# Altium schematic sheet ST-LINK_V2-1.SchDoc: ST-LINK V2-1
size A4; Date: Not used; ApprovedBy: Not used; CheckedBy: Not used; Author: Not used; CompanyName: STMicroelectronics; DrawnBy: Not used; Engineer: Not used; Organization: Not used; Address1: Not used; Address2: Not used; Address3: Not used; Address4: Not used; DocumentNumber: Not used; Revision: Not used; SheetNumber: 8; SheetTotal: 8; CurrentTime: Not used; CurrentDate: Not used; Time: Not used; DocumentFullPathAndName: Not used; DocumentName: Not used; ModifiedDate: Not used; ImagePath: Not used; ProjectName: Not used; Application_BuildNumber: Not used
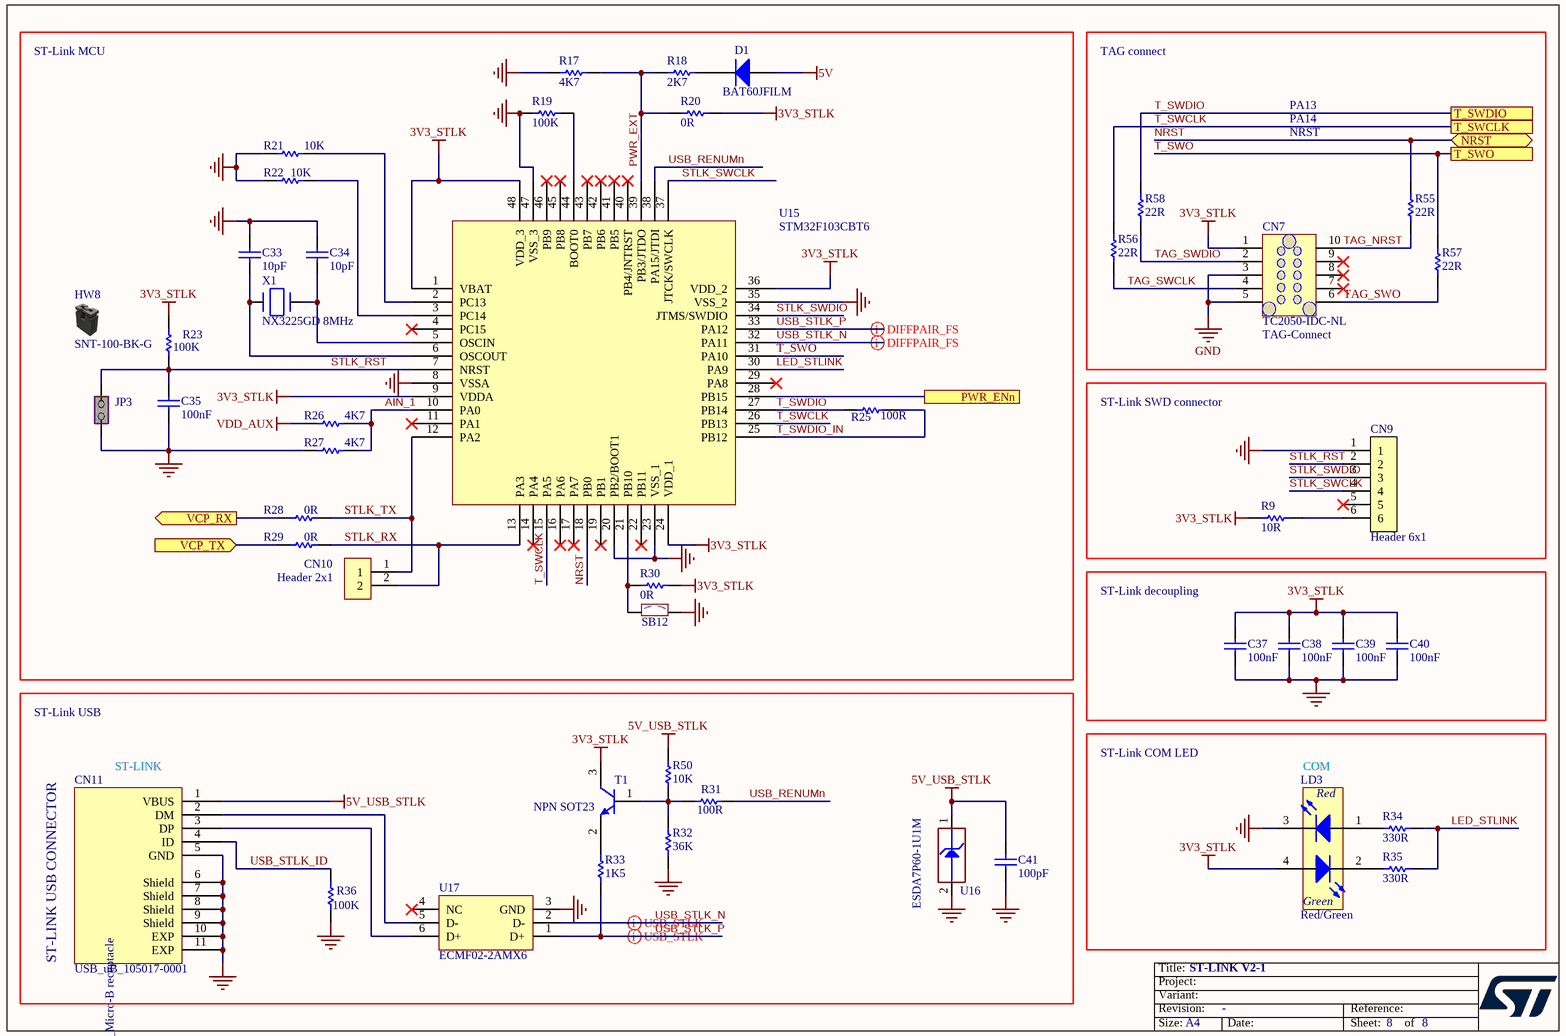
[diagram p0: ST-LINK_V2-1.SchDoc]

## Parts
C33  value 10pF  [C0402]  (hidden comment: Capacitor)
C34  value 10pF  [C0402]  (hidden comment: Capacitor)
C35  value 100nF  [C0402]  (hidden comment: Capacitor)
C37  value 100nF  [C0402]  (hidden comment: Capacitor)
C38  value 100nF  [C0402]  (hidden comment: Capacitor)
C39  value 100nF  [C0402]  (hidden comment: Capacitor)
C40  value 100nF  [C0402]  (hidden comment: Capacitor)
C41  value 100pF  [C0603_H0P8]  (hidden comment: Capacitor)
CN7  value TC2050-IDC-NL  [CON_TAG-C_TC2050-IDC-NL]  (hidden comment: Tag-10-C)
CN9  Header 6x1  [CON_SAMTEC_TSW-106-14-G-S]
CN10  Header 2x1  [CON_SAMTEC_TSW-102-07-G-S]
CN11  value USB_uB_105017-0001  [CON_USBMICROB_MOLEX_105017-0001_H2P90]  (hidden comment: USB_uB_105017.0001)
D1  BAT60JFILM  [DIO_SOD323]
HW8  value SNT-100-BK-G  (hidden comment: Shunt Black 2.54mm)  (mechanical)
JP3  Jumper_Header 2x1 Fitted  [CON_SAMTEC_TSW-102-07-G-S]  (value not drawn)
LD3  value Red/Green  [LED_BI-GR_WE-150141SV73110]  (hidden comment: LED_BICOLOR)
R9  value 10R  [R0402]  (hidden comment: Resistor)
R17  value 4K7  [R0402]  (hidden comment: Resistor)
R18  value 2K7  [R0402]  (hidden comment: Resistor)
R19  value 100K  [R0402]  (hidden comment: Resistor)
R20  value 0R  [R0402]  (hidden comment: Resistor)
R21  value 10K  [R0402]  (hidden comment: Resistor)
R22  value 10K  [R0402]  (hidden comment: Resistor)
R23  value 100K  [R0402]  (hidden comment: Resistor)
R25  value 100R  [R0402]  (hidden comment: Resistor)
R26  value 4K7  [R0402]  (hidden comment: Resistor)
R27  value 4K7  [R0402]  (hidden comment: Resistor)
R28  value 0R  [R0402]  (hidden comment: Resistor)
R29  value 0R  [R0402]  (hidden comment: Resistor)
R30  value 0R  [R0402]  (hidden comment: Resistor)
R31  value 100R  [R0402]  (hidden comment: Resistor)
R32  value 36K  [R0402]  (hidden comment: Resistor)
R33  value 1K5  [R0402]  (hidden comment: Resistor)
R34  value 330R  [R0402]  (hidden comment: Resistor)
R35  value 330R  [R0402]  (hidden comment: Resistor)
R36  value 100K  [R0402]  (hidden comment: Resistor)
R50  value 10K  [R0402]  (hidden comment: Resistor)
R55  value 22R  [R0402]  (hidden comment: Resistor)
R56  value 22R  [R0402]  (hidden comment: Resistor)
R57  value 22R  [R0402]  (hidden comment: Resistor)
R58  value 22R  [R0402]  (hidden comment: Resistor)
SB12  SB_OFF  [SOLDER-BRIDGE_R0603-0R]  (value not drawn)
T1  value NPN SOT23  [NPN_SOT23]  (hidden comment: 9013-SOT23)
U15  STM32F103CBT6  [ICC_LQFP48_7X7_P050]
U16  value ESDA7P60-1U1M  [ESD_QFN2_1P6X1_P125]  (hidden comment: ESD-TRANSIL)
U17  ECMF02-2AMX6  [ESD_QFN-6L_1P7X1P5_P050]
X1  value NX3225GD 8MHz  [CRY_NX3225GD_2P]  (hidden comment: XTAL_2_PINS)

## Blocks framed on the sheet
ST-Link MCU: C33-C35 CN10 D1 HW8 JP3 R17-R23 R25-R30 SB12 U15 X1
ST-Link SWD connector: CN9 R9
ST-Link decoupling: C37-C40
ST-LINK USB CONNECTOR: C41 CN11 R31-R33 R36 R50 T1 U16 U17

## Ports
NRST (bidir), PWR_ENn, T_SWCLK, T_SWDIO, T_SWO, VCP_RX (out), VCP_TX (in)

## Nets
3V3_STLK: C37.2 C38.2 C39.2 C40.2 CN7.1 LD3.4(Green_anode) R9.1 R20.2 R23.2 R30.2 T1.3(C) U15.1(VBAT) U15.9(VDDA) U15.24(VDD_1) U15.36(VDD_2) U15.48(VDD_3)
5V: D1.1(A)
5V_USB_STLK: C41.1 CN11.1(VBUS) R50.2 U16.1(IO1)
GND: C33.2 C34.2 C35.1 C37.1 C38.1 C39.1 C40.1 C41.2 CN7.3 CN7.5 CN9.1 CN11.5(GND) CN11.6(Shield) CN11.7(Shield) CN11.8(Shield) CN11.9(Shield) CN11.10(EXP) CN11.11(EXP) JP3.2(NO) LD3.3(RED_cathode) R17.1 R19.1 R21.2 R22.1 R27.1 R32.1 R36.1 SB12.2 U15.8(VSSA) U15.20(PB2/BOOT1) U15.23(VSS_1) U15.35(VSS_2) U15.47(VSS_3) U16.2(GND) U17.3(GND)
VDD_AUX: R26.1
AIN_1: R26.2 R27.2 U15.10(PA0)
LED_STLINK: R34.2 R35.2 U15.30(PA9)
NRST: R55.2 U15.18(PB0) ; port NRST
PWR_ENn: U15.28(PB15) ; port PWR_ENn
PWR_EXT: R17.2 R18.1 R20.1 U15.39(PB3/JTDO)
STLK_RST: C35.2 CN9.2 JP3.1(COMMON) R23.1 U15.7(NRST)
STLK_RX: CN10.2 R29.2 U15.13(PA3)
STLK_SWCLK: CN9.4 U15.37(JTCK/SWCLK)
STLK_SWDIO: CN9.3 U15.34(JTMS/SWDIO)
STLK_TX: CN10.1 R28.1 U15.12(PA2)
T_SWCLK: R56.2 U15.15(PA5) U15.26(PB13) ; port T_SWCLK
T_SWDIO: R25.1 R58.2 U15.27(PB14) ; port T_SWDIO
T_SWDIO_IN: R25.2 U15.25(PB12)
T_SWO: R57.1 U15.31(PA10) ; port T_SWO
TAG_NRST: CN7.10 R55.1
TAG_SWCLK: CN7.4 R56.1
TAG_SWDIO: CN7.2 R58.1
TAG_SWO: CN7.6 R57.2
USB_RENUMn: R31.2 U15.38(PA15/JTDI)
USB_STLK_ID: CN11.4(ID) R36.2
USB_STLK_N: U15.32(PA11) U17.2(D-)
USB_STLK_P: R33.1 U15.33(PA12) U17.1(D+)
VCP_RX: R28.2 ; port VCP_RX
VCP_TX: R29.1 ; port VCP_TX
NetC33_1: C33.1 U15.6(OSCOUT) X1.2(X2)
NetC34_1: C34.1 U15.5(OSCIN) X1.1(X1)
NetCN9_6: CN9.6 R9.2
NetCN11_2: CN11.2(DM) U17.5(D-)
NetCN11_3: CN11.3(DP) U17.6(D+)
NetD1_2: D1.2(K) R18.2
NetLD3_1: LD3.1(Red_anode) R34.1
NetLD3_2: LD3.2(Green_cathode) R35.1
NetR19_2: R19.2 U15.44(BOOT0)
NetR21_1: R21.1 U15.2(PC13)
NetR22_2: R22.2 U15.3(PC14)
NetR30_1: R30.1 SB12.1 U15.21(PB10)
NetR31_1: R31.1 R32.2 R50.1 T1.1(B)
NetR33_2: R33.2 T1.2(E)

Not connected (* = marked no-connect by the designer): CN7 7* 8* 9*; CN9 5*; U15 4(PC15)* 11(PA1)* 14(PA4)* 16(PA6)* 17(PA7)* 19(PB1)* 22(PB11)* 29(PA8)* 40(PB4/JNTRST)* 41(PB5)* 42(PB6)* 43(PB7)* 45(PB8)* 46(PB9)*; U17 4(NC)*

## Layout directives
differential pair: USB_STLK_N, USB_STLK_P

## Notes on the sheet
- TAG connect
- PA13
- PA14
- NRST
- (near CN7) TAG-Connect
- ST-Link USB
- (near CN11) ST-LINK
- ST-Link COM LED
- COM
- Title:
- Project:
- Size:
- Revision:
- Variant:
- A4
- -
- Date:
- Reference:
- Sheet:
- of
- (in symbol MCD-00028) USB_Micro-B receptacle
- (in symbol MCD-02631) Red; Green

## Library data of the parts
C33 C34 = MCD-00015: Capacitor, MLCC, 10pF, 50V, NPO, +/-5%, 0402, T=0,5mm; Manufacturer_Part_Number: CC0402JRNPO9BN100; Manufacturer: YAGEO; Part_Preference: Recommended; Internal_Part_Number: MCD-00015; Status: Released; Part_Type: Capacitor; Package: C0402; ComponentLink1URL: http://tunmcdsvn.tun.st.com/Component_Datasheet_Library/Trunk/Capacitors/Yageo_Capacitor_NP0_16V-to-50V
C35 C37-C40 = MCD-00006: Capacitor, MLCC, 100nF, 16V, X7R, +/-10%, 0402, T=0.5mm; Manufacturer_Part_Number: CC0402KRX7R7BB104; Manufacturer: YAGEO; Alternate_Manufacturer_Part_Number: GCM155R71C104KA55D; Alternate_Manufacturer: MURATA; Part_Preference: Recommended; Order_Code_RS: 616-9701; Internal_Part_Number: MCD-00006; Status: Released; Part_Type: Capacitor; Package: C0402; ComponentLink1URL: http://tunmcdsvn.tun.st.com/Component_Datasheet_Library/Trunk/Capacitors/Yageo_Multilayer_Capacitor_X7R_series_100pF_to_22uF; Order_Code_Digikey: 311-1338-1-ND; Order_Code_Farnell: 9402047
C41 = MCD-01648: Capacitor,MLCC,100pF 50V,NPO,+/-5%, 0603,T=0,8mm; Manufacturer_Part_Number: CC0603JRNPO9BN101; Manufacturer: YAGEO; Part_Preference: Recommended; Order_Code_RS: 625-0267; Internal_Part_Number: MCD-01648; Status: Released; Part_Type: Capacitor; Package: C0603; ComponentLink1URL: http://tunmcdsvn.tun.st.com/Component_Datasheet_Library/Trunk/Capacitors/Yageo_UPY-GP_NP0_16V-to-50V/YAGEO_NP0_UPY-GP_NP0_16V-to-50V_16.pdf; Order_Code_Digikey: 311-1069-1-ND; Order_Code_Farnell: 722080
CN7 = MCD-00031: Tag_Connector Header, 10x2, No legs; Manufacturer_Part_Number: TC2050-IDC-NL-FP; Manufacturer: TAG-CONNECT LLC; Part_Preference: Recommended; Internal_Part_Number: MCD-00031; Status: Released; Part_Type: Connector; ComponentLink1URL: http://tunmcdsvn.tun.st.com/Component_Datasheet_Library/Trunk/Connectors/TAG_Connector_TC2050-IDC-NLFP
CN9 = MCD-01592: Header 6x1, 2,54mm, height 10.67mm; Part_Type: Connector; Manufacturer_Part_Number: TSW-106-14-G-S; Manufacturer: SAMTEC; Part_Preference: Recommended; Order_Code_RS: 180-1121; Internal_Part_Number: MCD-01592; Value: Header 6x1; Status: Checked; ComponentLink1URL: http://tunmcdsvn.tun.st.com/Component_Datasheet_Library/Trunk/Connectors/Samtec_TSW-HTSW-series/Samtec_TSW-HTSW-series.pdf; Alternate_Manufacturer: N/A; Alternate_Manufacturer_Part_Number: N/A; Order_Code_Digikey: SAM1053-06-ND; Order_Code_Farnell: 2037181
CN10 = MCD-00032: Header, 2x1, 2,54mm, VR, TH, Height 5.84mm/2.54mm; Manufacturer_Part_Number: TSW-102-07-G-S; Manufacturer: SAMTEC; Part_Type: Connector; Alternate_Manufacturer_Part_Number: 313102S111116; Alternate_Manufacturer: JIUBABA; Part_Preference: Recommended; Value: Header 2x1; Internal_Part_Number: MCD-00032; Status: Released; ComponentLink1URL: http://tunmcdsvn.tun.st.com/Component_Datasheet_Library/Trunk/Connectors/Samtec_TSW-HTSW-series
CN11 = MCD-00028: USB-MICRO-B, 0.65mm, RA, SMT, Bottom Mount,; Manufacturer_Part_Number: 1050170001; Manufacturer: MOLEX; Part_Type: Connector; Part_Preference: Recommended; Internal_Part_Number: MCD-00028; Status: Released; ComponentLink1URL: http://tunmcdsvn.tun.st.com/Component_Datasheet_Library/Trunk/Connectors/Molex_Connector-USB-microB_105017-0001
D1 = MCD-00034: Manufacturer: STMICROELECTRONICS; Part_Type: Diode; BMS_Part_Number: 9151097; Part_Preference: Recommended; Manufacturer_HQ_COO: EU; Internal_Part_Number: MCD-00034; Value: BAT60JFILM; Manufacturer_Part_Number: BAT60JFILM; Status: Released; ComponentLink1URL: http://tunmcdsvn.tun.st.com/Component_Datasheet_Library/Trunk/Diodes/STM_Diode_BAT60JFILM-SOD323
HW8 = MCD-00122: Shunt, 2.54mm, Black, 4.3A, 6.1mm, 5mR; Part_Type: Misc; Part_Preference: Recommended; Manufacturer: SAMTEC; Full_Alternate_Internal_Part_Number: MCD-00043; Partial_Alternate_Internal_Part_Number: MCD-01849; Order_Code_RS: 158-7784; Component_Country_Of_Origin: China, Costa Rica, Malaysia, USA, Vietnam; ShowFields: YES; ID: 2749; Internal_Part_Number: MCD-00122; Status: Released; Manufacturer_Part_Number: SNT-100-BK-G; Package: 2.54x5.08mm; ComponentLink1URL: http://tunmcdsvn.tun.st.com/Component_Documentation_Library/Trunk/Misc/SAMTEC_SNT-100-BK-G; Order_Code_Digikey: SAM8858-ND; Order_Code_Farnell: 2505007
JP3 = MCD-01904: Header, 2x1, 2,54mm, VR, TH, Height 5.84mm/2.54mm - Shunt Fitted by default; Part_Type: Connector; Manufacturer_Part_Number: TSW-102-07-G-S; Manufacturer: SAMTEC; Part_Preference: Recommended; Order_Code_RS: 155-7981; Internal_Part_Number: MCD-01904; Value: Header 2x1; Status: Checked; ComponentLink1URL: http://tunmcdsvn.tun.st.com/Component_Datasheet_Library/Trunk/Connectors/Samtec_TSW-HTSW-series; Alternate_Manufacturer: N/A; Alternate_Manufacturer_Part_Number: N/A; Order_Code_Digikey: SAM1029-02-ND; Order_Code_Farnell: 2505044
LD3 = MCD-02631: LED Bicolor, Red/Green, 2V, 20mA, 4-PLCC; Part_Type: Display; Part_Preference: Recommended; Manufacturer: WURTH ELEKTRONIK; Manufacturer_Part_Number: 150141SV73110; Order_Code_RS: 184-6963; Component_Country_Of_Origin: China; ShowFields: YES; ID: 4737; Internal_Part_Number: MCD-02631; Status: Released; Package: 4-PLCC; ComponentLink1URL: http://tunmcdsvn.tun.st.com/Component_Documentation_Library/Trunk/Display/WURTH_ELEKTRONIK_150141SV73110; Order_Code_Digikey: 732-13404-2-ND; Order_Code_Farnell: 2990869
R9 = MCD-00358: Resistor,10R,0402,1%,1/16W; Manufacturer_Part_Number: RC0402FR-0710RL; Manufacturer: YAGEO; Part_Preference: Recommended; Order_Code_RS: 618-5848; Internal_Part_Number: MCD-00358; Status: Released; Part_Type: Resistor; Package: R0402; ComponentLink1URL: http://tunmcdsvn.tun.st.com/Component_Datasheet_Library/Trunk/Resistors/Yageo_Resistor_RC0402-series; Order_Code_Digikey: 311-10.0LRCT-ND; Order_Code_Farnell: 9238999
R17 R26 R27 = MCD-00065: Resistor,4K7,0402,1%,1/16W; Manufacturer_Part_Number: RC0402FR-074K7L; Manufacturer: YAGEO; Alternate_Manufacturer_Part_Number: RT0402FRE074K7L; Part_Preference: Recommended; Internal_Part_Number: MCD-00065; Alternate_Manufacturer: YAGEO; Status: Released; Part_Type: Resistor; ComponentLink1URL: http://tunmcdsvn.tun.st.com/Component_Datasheet_Library/Trunk/Resistors/Yageo_Resistor_RC0402-series; Package: R0402; Order_Code_Digikey: 311-4.7KLRCT-ND; Order_Code_Farnell: 9239316; Order_Code_RS: N/A
R18 = MCD-00055: Resistor,2K7,0402,1%,1/16W; Manufacturer_Part_Number: RC0402FR-072K7L; Manufacturer: YAGEO; Part_Preference: Recommended; Internal_Part_Number: MCD-00055; Status: Released; Part_Type: Resistor; ComponentLink1URL: http://tunmcdsvn.tun.st.com/Component_Datasheet_Library/Trunk/Resistors/Yageo_Resistor_RC0402-series; Package: R0402; Order_Code_Digikey: 311-2.70KLRCT-ND; Order_Code_Farnell: 9239286; Order_Code_RS: N/A
R19 R23 R36 = MCD-00059: Resistor,100K,0402,1%,1/16W; Manufacturer_Part_Number: RC0402FR-07100KL; Manufacturer: YAGEO; Alternate_Manufacturer_Part_Number: RT0402FRE07100KL; Part_Preference: Recommended; Internal_Part_Number: MCD-00059; Alternate_Manufacturer: YAGEO; Status: Released; Part_Type: Resistor; ComponentLink1URL: http://tunmcdsvn.tun.st.com/Component_Datasheet_Library/Trunk/Resistors/Yageo_Resistor_RC0402-series; Package: R0402; Order_Code_Digikey: 311-100KLRTR-ND; Order_Code_Farnell: 2421891; Order_Code_RS: N/A
R20 R28-R30 = MCD-00052: Resistor,0R,0402,5%,1/16W; Manufacturer_Part_Number: RC0402JR-070RL; Manufacturer: YAGEO; Part_Preference: Recommended; Order_Code_RS: 618-5804; Internal_Part_Number: MCD-00052; Status: Released; Part_Type: Resistor; ComponentLink1URL: http://tunmcdsvn.tun.st.com/Component_Datasheet_Library/Trunk/Resistors/Yageo_Resistor_RC0402-series; Package: R0402; Order_Code_Digikey: 311-0.0JRCT-ND; Order_Code_Farnell: 9232516RL
R21 R22 R50 = MCD-00053: Resistor,10K,0402,1%,1/16W; Manufacturer_Part_Number: RC0402FR-0710KL; Manufacturer: YAGEO; BMS_Part_Number: 9131590; Part_Preference: Recommended; Internal_Part_Number: MCD-00053; Status: Released; Part_Type: Resistor; ComponentLink1URL: http://tunmcdsvn.tun.st.com/Component_Datasheet_Library/Trunk/Resistors/Yageo_Resistor_RC0402-series; Package: R0402; Order_Code_Digikey: 311-10.0KLRCT-ND; Order_Code_Farnell: 9239359; Order_Code_RS: N/A
R25 R31 = MCD-00067: Resistor,100R,0402,1%,1/16W; Manufacturer_Part_Number: RC0402FR-07100RL; Manufacturer: YAGEO; Part_Preference: Recommended; Internal_Part_Number: MCD-00067; Status: Released; Part_Type: Resistor; ComponentLink1URL: http://tunmcdsvn.tun.st.com/Component_Datasheet_Library/Trunk/Resistors/Yageo_Resistor_RC0402-series; Package: R0402; Order_Code_Digikey: 311-100LRCT-ND; Order_Code_Farnell: 9239111; Order_Code_RS: N/A
R32 = MCD-00069: Resistor,36K,0402,1%,1/16W; Manufacturer_Part_Number: RC0402FR-0736KL; Manufacturer: YAGEO; Part_Preference: Recommended; Internal_Part_Number: MCD-00069; Status: Released; Part_Type: Resistor; ComponentLink1URL: http://tunmcdsvn.tun.st.com/Component_Datasheet_Library/Trunk/Resistors/Yageo_Resistor_RC0402-series; Package: R0402; Order_Code_Digikey: 311-36.0KLRCT-ND; Order_Code_Farnell: 1458788; Order_Code_RS: N/A
R33 = MCD-00068: Resistor,1K5,0402,1%,1/16W; Manufacturer_Part_Number: RC0402FR-071K5L; Manufacturer: YAGEO; Part_Preference: Recommended; Internal_Part_Number: MCD-00068; Status: Released; Part_Type: Resistor; ComponentLink1URL: http://tunmcdsvn.tun.st.com/Component_Datasheet_Library/Trunk/Resistors/Yageo_Resistor_RC0402-series; Package: R0402; Order_Code_Digikey: 311-1.50KLRCT-ND; Order_Code_Farnell: 9239251; Order_Code_RS: N/A
R34 R35 = MCD-00062: Resistor,330R,0402,1%,1/16W; Manufacturer_Part_Number: RC0402FR-07330RL; Manufacturer: YAGEO; Part_Preference: Recommended; Internal_Part_Number: MCD-00062; Status: Released; Part_Type: Resistor; ComponentLink1URL: http://tunmcdsvn.tun.st.com/Component_Datasheet_Library/Trunk/Resistors/Yageo_Resistor_RC0402-series; Package: R0402; Order_Code_Digikey: 311-330LRCT-ND; Order_Code_Farnell: 9239170; Order_Code_RS: N/A
R55-R58 = MCD-00189: Resistor,22R,0402,1%,1/16W; Manufacturer_Part_Number: RC0402FR-0722RL; Manufacturer: YAGEO; Part_Preference: Recommended; Internal_Part_Number: MCD-00189; Status: Released; Part_Type: Resistor; Package: R0402; ComponentLink1URL: http://tunmcdsvn.tun.st.com/Component_Datasheet_Library/Trunk/Resistors/Yageo_Resistor_RC0402-series; Order_Code_Digikey: 311-22.0LRCT-ND; Order_Code_Farnell: 9239030; Order_Code_RS: N/A
SB12 = MCD-00072: Solder Bridge OFF; Part_Type: Misc; Manufacturer_Part_Number: RC0603JR-070RL; Manufacturer: YAGEO; Part_Preference: Recommended; Internal_Part_Number: MCD-00072; Status: Released; Package: SB0603; ComponentLink1URL: http://tunmcdsvn.tun.st.com/Component_Datasheet_Library/Trunk/Resistors/Yageo_Resistor_RC0603-series
T1 = MCD-00073: NPN Bipolar Transistor; Manufacturer_Part_Number: BSR14; Manufacturer: ON SEMICONDUCTOR; Part_Type: IC; Alternate_Manufacturer_Part_Number: MMBT2222LT1G / MMBT2222ALT1G / MMBT2222ALT3G; Part_Preference: Recommended; Revision: *; Internal_Part_Number: MCD-00073; Status: Released; ComponentLink1URL: http://tunmcdsvn.tun.st.com/Component_Datasheet_Library/Trunk/IC/NXP_Transistor_BSR14; Alternate_Manufacturer: ON SEMICONDUCTOR; Package: SOT23
U15 = MCD-00085: Medium-density performance line ARM-based 32-bit MCU with 128KB Flash; Manufacturer: STMICROELECTRONICS; Part_Type: IC; BMS_Part_Number: 9175111; Part_Preference: Recommended; Manufacturer_HQ_COO: EU; Value: STM32F103CBT6; Internal_Part_Number: MCD-00085; Manufacturer_Part_Number: STM32F103CBT6; Status: Released; ComponentLink1URL: http://tunmcdsvn.tun.st.com/Component_Datasheet_Library/Trunk/IC/STM_STM32F103CBT6
U16 = MCD-00251: High power transient voltage suppressor, 7V breakdown; Part_Type: Diode; Manufacturer: STMICROELECTRONICS; BMS_Part_Number: 9179042; Part_Preference: Recommended; Manufacturer_HQ_COO: EU; Internal_Part_Number: MCD-00251; Status: Released; Manufacturer_Part_Number: ESDA7P60-1U1M; ComponentLink1URL: http://tunmcdsvn.tun.st.com/Component_Datasheet_Library/Trunk/Diodes/STM_ESD_ESDA7P60-1U1M
U17 = MCD-00649: Common mode filter with ESD protection for USB 2.0 interface; Part_Type: Diode; Manufacturer: STMICROELECTRONICS; BMS_Part_Number: 9151138; Part_Preference: Recommended; Manufacturer_HQ_COO: EU; Internal_Part_Number: MCD-00649; Value: ECMF02-2AMX6; Status: Released; Manufacturer_Part_Number: ECMF02-2AMX6; ComponentLink1URL: http://tunmcdsvn.tun.st.com/Component_Datasheet_Library/Trunk/Diodes/STM_ESD_ECMF02-2AMX6
X1 = MCD-00092: Crystal 8MHz, 8pF, +-20ppm, 500ohms max,  SMD; Manufacturer_Part_Number: NX3225GD 8MHz EXS00A-CG04874; Manufacturer: NDK; Part_Type: Crystal oscillator; BMS_Part_Number: 9157029; Part_Preference: Recommended; Internal_Part_Number: MCD-00092; Status: Released; ComponentLink1URL: http://tunmcdsvn.tun.st.com/Component_Datasheet_Library/Trunk/Crystal_Osc/NDK_Crystal-For-ST_NX3225GD 8MHz EXS00A-CG04874 (EXS10B-20725); Order_Code_Digikey: 644-1391